# EAGLE schematic test1 (EAGLE 6.4)
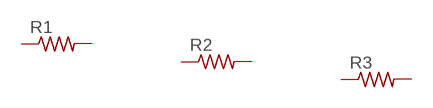
[diagram p0: schematic, sheet 1]

## Parts
R1  R-US_M0805  [M0805]
R2  R-US_M0805  [M0805]
R3  R-US_M0805  [M0805]
Unconnected: R1.1 R1.2 R2.1 R2.2 R3.1 R3.2

## Library data of the parts
R1-R3 = rcl:R-US_: RESISTOR, American symbol